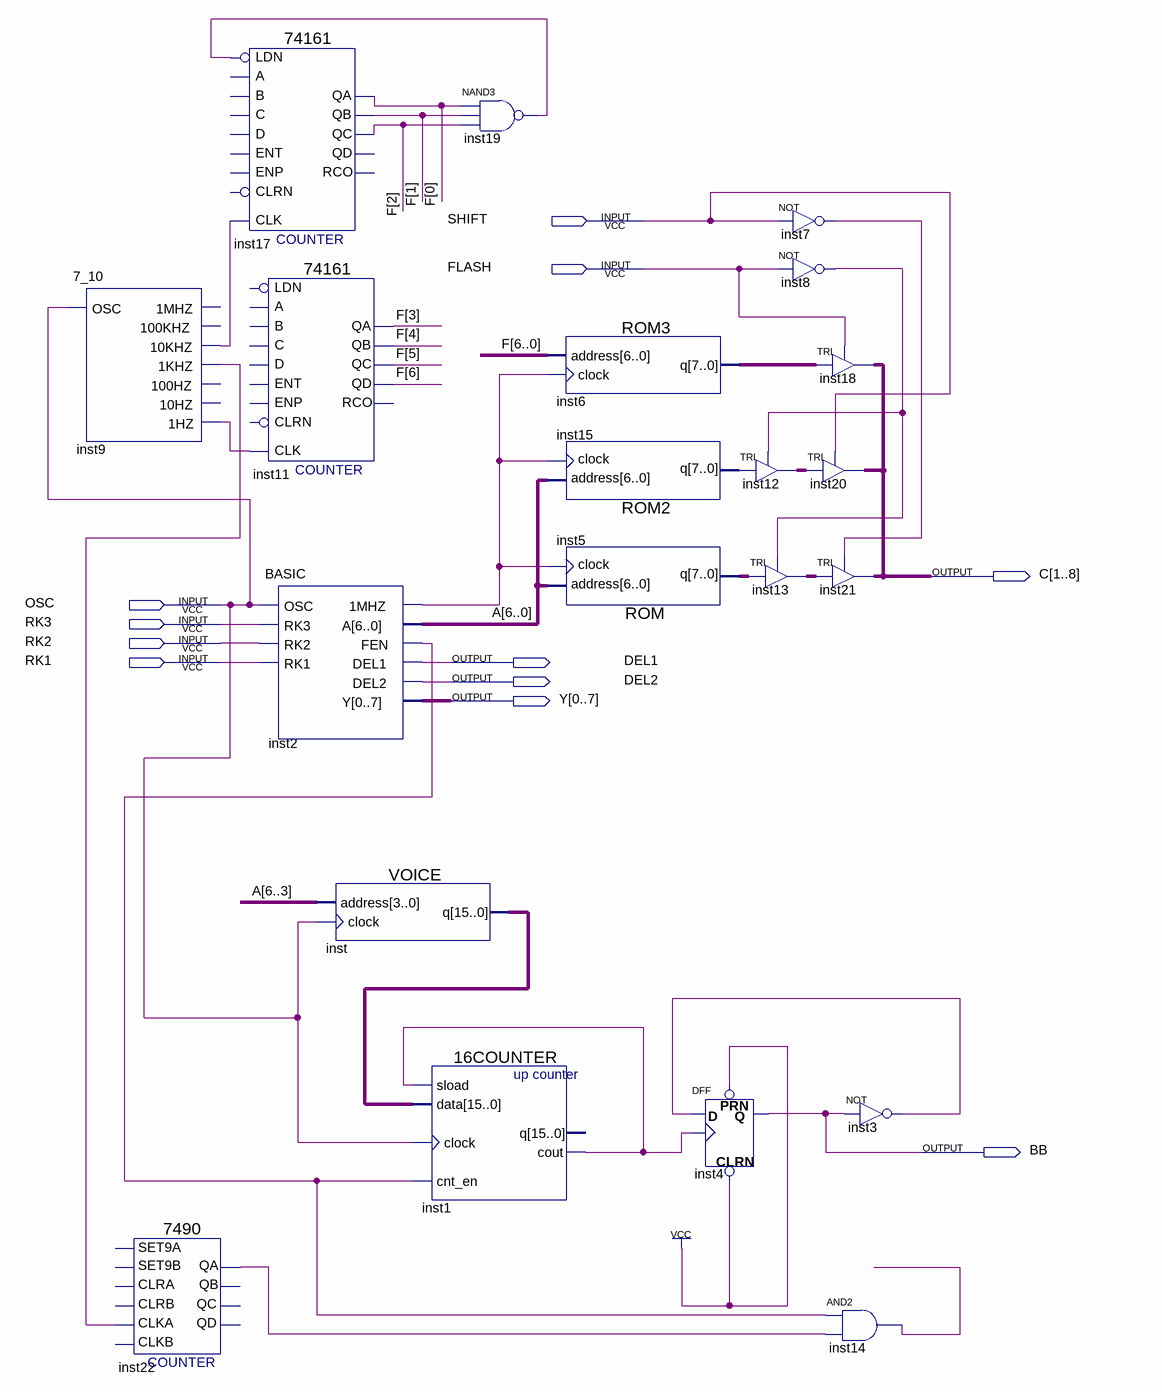
[diagram p0: schematic sheet]
// Quartus schematic MAIN.bdf as structural Verilog: 21 symbols, 11 pins
module MAIN (
  input  SHIFT,
  input  FLASH,
  input  OSC,
  input  RK3,
  input  RK2,
  input  RK1,
  output [1:8] C,
  output DEL1,
  output DEL2,
  output [0:7] Y,
  output BB
);

  wire inst1_cout, inst2_1mhz, inst2_fen, inst3_out, inst7_out, inst8_out, inst9_1hz, inst9_1khz,
       inst9_10khz, inst14_out, inst19_out, inst22_qa;
  wire [6:0] A, F;
  wire [7:0] inst5_q, inst6_q, inst12_out, inst13_out, inst15_q;
  wire [15:0] inst_q;

  \7_10  inst9 (
    .OSC(OSC), .\10KHZ (inst9_10khz), .\1KHZ (inst9_1khz), .\1HZ (inst9_1hz));  // open: 1MHZ, 100KHZ, 100HZ, 10HZ
  \7490  inst22 (.CLKA(inst9_1khz), .QA(inst22_qa));  // open: SET9A, CLRA, SET9B, CLKB, CLRB, QD, QB, QC
  \74161  inst17 (
    .CLK(inst9_10khz), .LDN(inst19_out), .QC(F[2]), .QB(F[1]), .QA(F[0]));  // open: CLRN, ENP, A, D, ENT, B, C, QD, RCO
  \74161  inst11 (
    .CLK(inst9_1hz), .QD(F[6]), .QC(F[5]), .QB(F[4]), .QA(F[3]));  // open: CLRN, ENP, LDN, A, D, ENT, B, C, RCO
  BASIC inst2 (
    .OSC(OSC), .RK3(RK3), .RK2(RK2), .RK1(RK1), .\1MHZ (inst2_1mhz), .A(A), .FEN(inst2_fen), .DEL1(DEL1),
    .DEL2(DEL2), .Y(Y));
  VOICE inst (.address(A[6:3]), .clock(OSC), .q(inst_q));
  \16COUNTER  inst1 (.sload(inst1_cout), .data(inst_q), .clock(OSC), .cnt_en(inst2_fen), .cout(inst1_cout));  // open: q
  nand inst19 (inst19_out, F[0], F[1], F[2]);
  ROM3 inst6 (.address(F), .clock(inst2_1mhz), .q(inst6_q));
  ROM2 inst15 (.address(A), .clock(inst2_1mhz), .q(inst15_q));
  ROM inst5 (.address(A), .clock(inst2_1mhz), .q(inst5_q));
  DFF inst4 (.CLRN(1'b1), .CLK(inst1_cout), .D(inst3_out), .PRN(1'b1), .Q(BB));
  not inst7 (inst7_out, SHIFT);
  not inst8 (inst8_out, FLASH);
  TRI inst12[7:0] (.IN(inst15_q), .OE(inst8_out), .OUT(inst12_out));
  TRI inst13[7:0] (.IN(inst5_q), .OE(inst8_out), .OUT(inst13_out));
  TRI inst18[7:0] (.IN(inst6_q), .OE(FLASH), .OUT(C));
  TRI inst20[7:0] (.IN(inst12_out), .OE(SHIFT), .OUT(C));
  TRI inst21[7:0] (.IN(inst13_out), .OE(inst7_out), .OUT(C));
  not inst3 (inst3_out, BB);
  and inst14 (inst14_out, inst2_fen, inst22_qa);
endmodule
